# EAGLE design EduBasicaV2 (EAGLE 6.5.0)
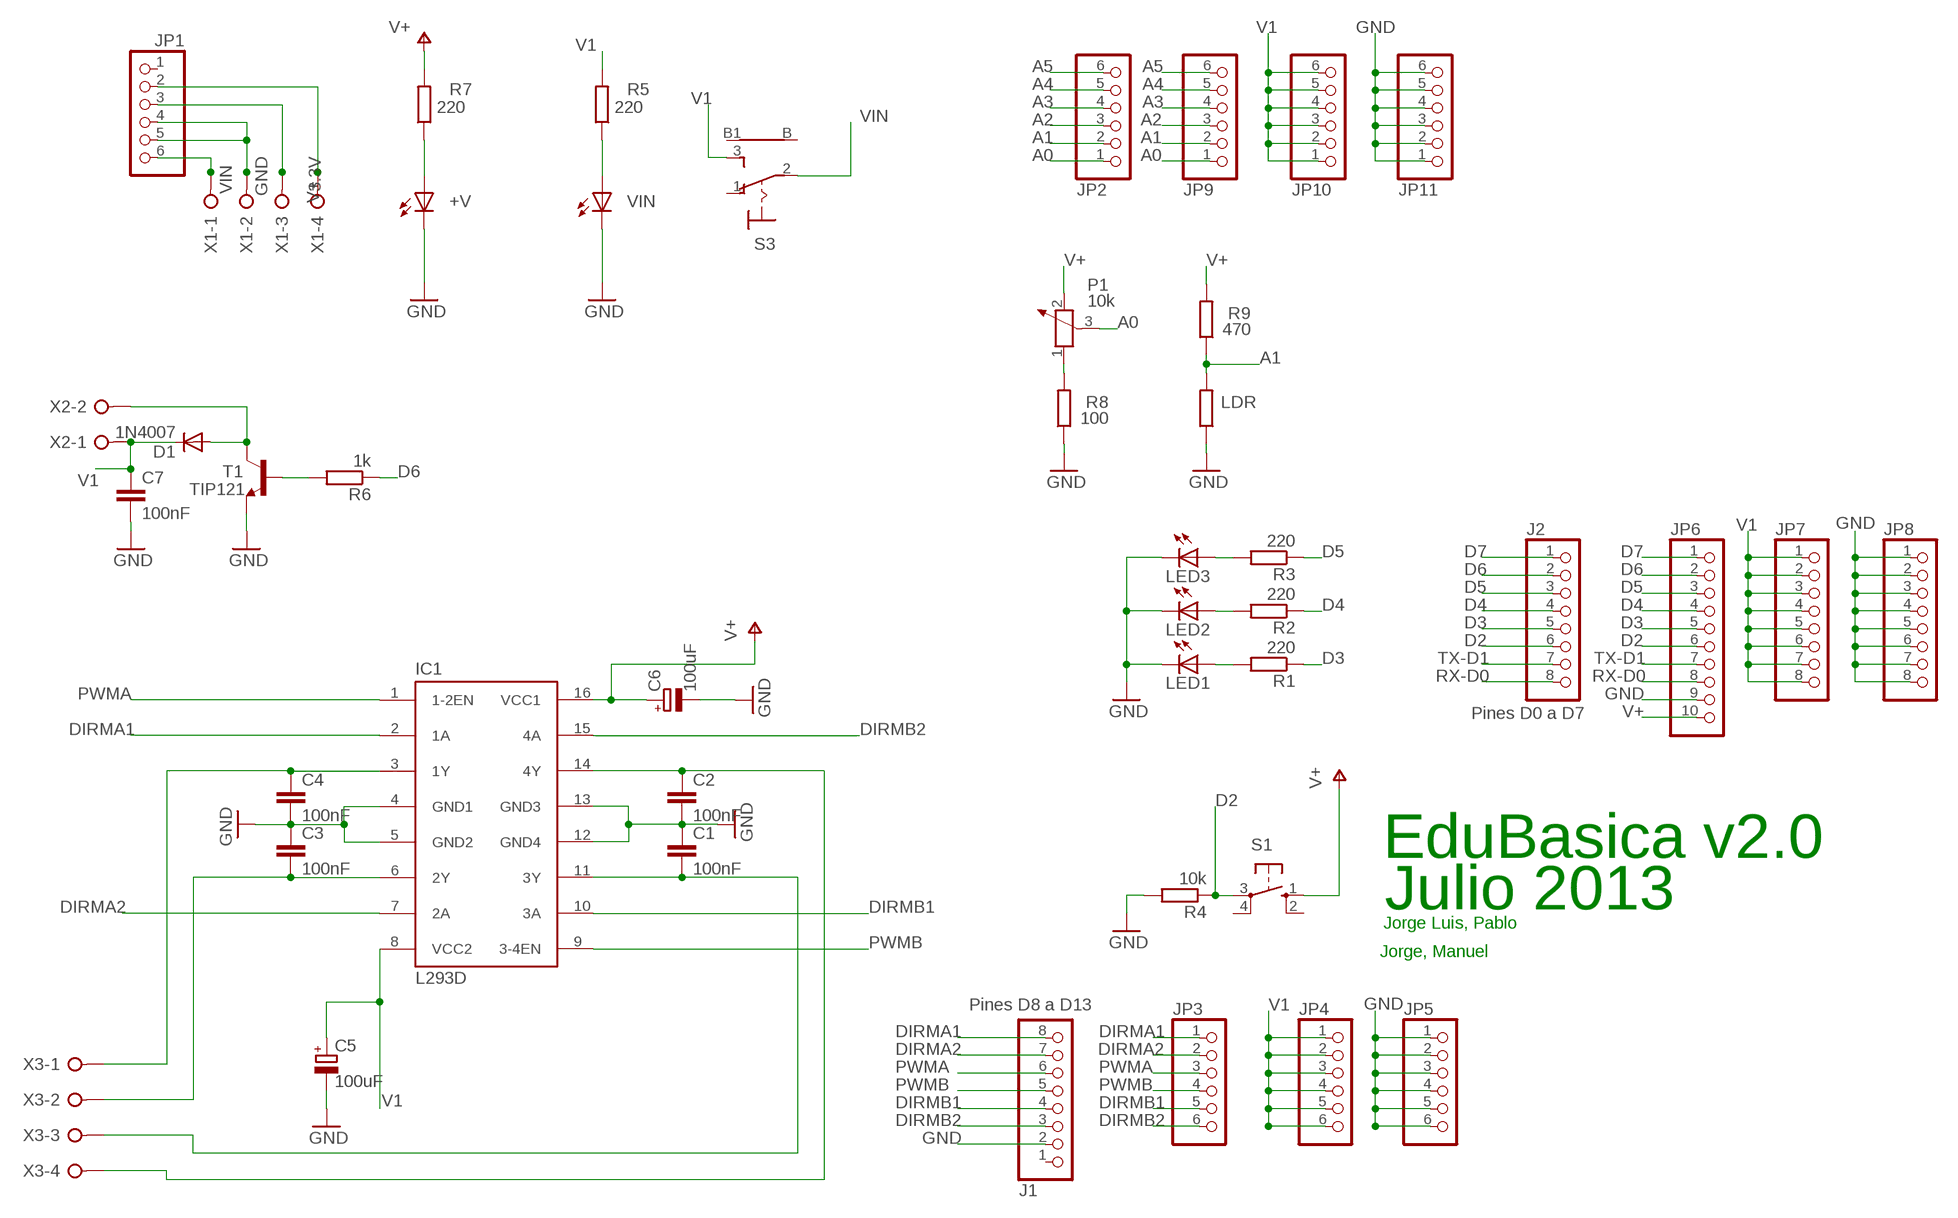
[diagram p0: schematic, sheet 1]

## Parts
+V  LED3MM  [LED3MM]
C1  100nF  C5/5.5  [C5B5.5]
C2  100nF  C5/5.5  [C5B5.5]
C3  100nF  C5/5.5  [C5B5.5]
C4  100nF  C5/5.5  [C5B5.5]
C5  100uF  CPOL-EUE2.5-5  [E2,5-5]
C6  100uF  CPOL-EUE2.5-5  [E2,5-5]
C7  100nF  C5/5.5  [C5B5.5]
D1  1N4007  DIODE-D-7.5  [D-7.5]
IC1  L293D  L293E  [DIL16]
J1  Pines D8 a D13  PINHD-1X8  [1X08]
J2  Pines D0 a D7  PINHD-1X8  [1X08]
JP1  PINHD-1X6  [1X06]
JP2  PINHD-1X6  [1X06]
JP3  PINHD-1X6  [1X06]
JP4  PINHD-1X6  [1X06]
JP5  PINHD-1X6  [1X06]
JP6  PINHD-1X10  [1X10]
JP7  PINHD-1X8  [1X08]
JP8  PINHD-1X8  [1X08]
JP9  PINHD-1X6  [1X06]
JP10  PINHD-1X6  [1X06]
JP11  PINHD-1X6  [1X06]
LDR  R-EU_0204/2V  [0204V]
LED1  LED5MM  [LED5MM]
LED2  LED5MM  [LED5MM]
LED3  LED5MM  [LED5MM]
P1  10k  POTENTIOMETER_PT-10  [PT-10]
R1  220  R-EU_0204/7  [0204/7]
R2  220  R-EU_0204/7  [0204/7]
R3  220  R-EU_0204/7  [0204/7]
R4  10k  R-EU_0204/7  [0204/7]
R5  220  R-EU_0204/7  [0204/7]
R6  1k  R-EU_0204/7  [0204/7]
R7  220  R-EU_0204/7  [0204/7]
R8  100  R-EU_0204/7  [0204/7]
R9  470  R-EU_0204/7  [0204/7]
S1  10-XX  [B3F-10XX]
S3  9070-1W  [9070-1W]
T1  TIP121  -NPN-TO220V  [TO220V]
VIN  LED3MM  [LED3MM]
X1  W237-04P  [W237-4P]
X2  W237-02P  [W237-132]
X3  W237-04P  [W237-4P]

## Nets
3.3V: JP1.2 X1.4
A0: JP2.1 JP9.1 P1.3
A1: JP2.2 JP9.2 LDR.2 R9.1
A2: JP2.3 JP9.3
A3: JP2.4 JP9.4
A4: JP2.5 JP9.5
A5: JP2.6 JP9.6
D2: J2.6 JP6.6 R4.1 S1.3(P)
D3: J2.5 JP6.5 R1.1
D4: J2.4 JP6.4 R2.1
D5: J2.3 JP6.3 R3.1
D6: J2.2 JP6.2 R6.1
D7: J2.1 JP6.1
DIRMA1: IC1.2(1A) J1.8 JP3.1
DIRMA2: IC1.7(2A) J1.7 JP3.2
DIRMB1: IC1.10(3A) J1.4 JP3.5
DIRMB2: IC1.15(4A) J1.3 JP3.6
GND: +V.K(C) C1.1 C2.2 C3.1 C4.2 C5.- C6.- C7.2 IC1.4(GND1) IC1.5(GND2) IC1.12(GND4) IC1.13(GND3) J1.2 JP1.4 JP1.5 JP5.1 JP5.2 JP5.3 JP5.4 JP5.5 JP5.6 JP6.9 JP8.1 JP8.2 JP8.3 JP8.4 JP8.5 JP8.6 JP8.7 JP8.8 JP11.1 JP11.2 JP11.3 JP11.4 JP11.5 JP11.6 LDR.1 LED1.K(C) LED2.K(C) LED3.K(C) R4.2 R8.1 T1.3(E) VIN.K(C) X1.2
N$2: R6.2 T1.1(B)
N$3: D1.A T1.2(C) X2.2
N$4: P1.1 R8.2
N$6: R5.1 VIN.A
N$8: LED3.A R3.2
N$9: LED2.A R2.2
N$10: LED1.A R1.2
N$16: JP7.7
N$30: C4.1 IC1.3(1Y) X3.1
N$31: C3.2 IC1.6(2Y) X3.2
N$32: C1.2 IC1.11(3Y) X3.3
N$33: C2.1 IC1.14(4Y) X3.4
N$35: +V.A R7.1
PWMA: IC1.1(1-2EN) J1.6 JP3.3
PWMB: IC1.9(3-4EN) J1.5 JP3.4
RX-D0: J2.8 JP6.8
TX-D1: J2.7 JP6.7
V1: C5.+ C7.1 D1.C IC1.8(VCC2) JP4.1 JP4.2 JP4.3 JP4.4 JP4.5 JP4.6 JP7.1 JP7.2 JP7.3 JP7.4 JP7.5 JP7.6 JP7.8 JP10.1 JP10.2 JP10.3 JP10.4 JP10.5 JP10.6 R5.2 S3.3(S) X2.1
V+: C6.+ IC1.16(VCC1) JP1.3 JP6.10 P1.2 R7.2 R9.2 S1.1(S) X1.3
VIN [power]: JP1.6 S3.2(P) X1.1
Unconnected: J1.1 JP1.1 S1.2(S1) S1.4(P1) S3.1(O) S3.B S3.B1

## Notes on the sheet
- EduBasica v2.0
- Julio 2013
- Jorge Luis, Pablo
- Jorge, Manuel

## Library data of the parts
+V LED1-LED3 VIN = led:LED: LED OSRAM: - CHIPLED LG R971, LG N971, LY N971, LG Q971, LY Q971, LO R971, LY R971 LH N974, LH R974 LS Q976, LO Q976, LY Q976 LO Q996 - Hyper CHIPLED LW Q18S LB Q993, LB Q99A, LB R99A - SideLED LS A670, LO A670, LY A670, LG A670, LP A670 LB A673, LV A673, LT A673, LW A673 LH A674 LY A675 LS A676, LA A676, LO A676, LY A676, LW A676 LS A679, LY A679, LG A679 - Hyper Micro SIDELED® LS Y876, LA Y876, LO Y876, LY Y876 LT Y87S - SmartLED LW L88C, LW L88S LB L89C, LB L89S, LG L890 LS L89K, LO L89K, LY L89K LS L896, LA L896, LO L896, LY L896 - TOPLED LS T670, LO T670, LY T670, LG T670, LP T670 LSG T670, LSP T670, LSY T670, LOP T670, LYG T670 LG T671, LOG T671, LSG T671 LB T673, LV T673, LT T673, LW T673 LH T674 LS T676, LA T676, LO T676, LY T676, LB T676, LH T676, LSB T676, LW T676 LB T67C, LV T67C, LT T67C, LS T67K, LO T67K, LY T67K, LW E67C LS E67B, LA E67B, LO E67B, LY E67B, LB E67C, LV E67C, LT E67C LW T67C LS T679, LY T679, LG T679 LS T770, LO T770, LY T770, LG T770, LP T770 LB T773, LV T773, LT T773, LW T773 LH T774 LS E675, LA E675, LY E675, LS T675 LS T776, LA T776, LO T776, LY T776, LB T776 LHGB T686 LT T68C, LB T68C - Hyper Mini TOPLED® LB M676 - Mini TOPLED Santana® LG M470 LS M47K, LO M47K, LY M47K Source: http://www.osram.convergy.de LUXEON: - LUMILED® LXK2-PW12-R00, LXK2-PW12-S00, LXK2-PW14-U00, LXK2-PW14-V00 LXK2-PM12-R00, LXK2-PM12-S00, LXK2-PM14-U00 LXK2-PE12-Q00, LXK2-PE12-R00, LXK2-PE12-S00, LXK2-PE14-T00, LXK2-PE14-U00 LXK2-PB12-K00, LXK2-PB12-L00, LXK2-PB12-M00, LXK2-PB14-N00, LXK2-PB14-P00, LXK2-PB14-Q00 LXK2-PR12-L00, LXK2-PR12-M00, LXK2-PR14-Q00, LXK2-PR14-R00 LXK2-PD12-Q00, LXK2-PD12-R00, LXK2-PD12-S00 LXK2-PH12-R00, LXK2-PH12-S00 LXK2-PL12-P00, LXK2-PL12-Q00, LXK2-PL12-R00 Source: www.luxeon.com KINGBRIGHT: KA-3528ASYC Source: www.kingbright.com
C1-C4 C7 = capacitor-wima:C: CAPACITOR naming: grid - package width
C5 C6 = rcl:CPOL-EU: POLARIZED CAPACITOR, European symbol
D1 = diode:DIODE-: DIODE
IC1 = texas:L293E: TI DEVICE
J1 J2 JP7 JP8 = pinhead:PINHD-1X8: PIN HEADER
JP1-JP5 JP9-JP11 = pinhead:PINHD-1X6: PIN HEADER
JP6 = pinhead:PINHD-1X10: PIN HEADER
LDR R1-R9 = rcl:R-EU_: RESISTOR, European symbol
P1 = rcl:POTENTIOMETER_: Potentiometer
S1 = switch-omron:10-XX: OMRON SWITCH; MPN: B3F-1000; OC_FARNELL: 176432; OC_NEWARK: 36M3542
S3 = switch:9070-1W: TOGGLE SWITCH Marquardt
T1 = transistor:*-NPN-: NPN Transistror BF959 corrected 2008.03.06
X1 X3 = con-wago-508:W237-04P: WAGO SREW CLAMP; OC_FARNELL: unknown; OC_NEWARK: unknown
X2 = con-wago-508:W237-02P: WAGO SREW CLAMP; OC_FARNELL: unknown; OC_NEWARK: unknown

## Net classes
1 power: width 0.61 mm

## Board
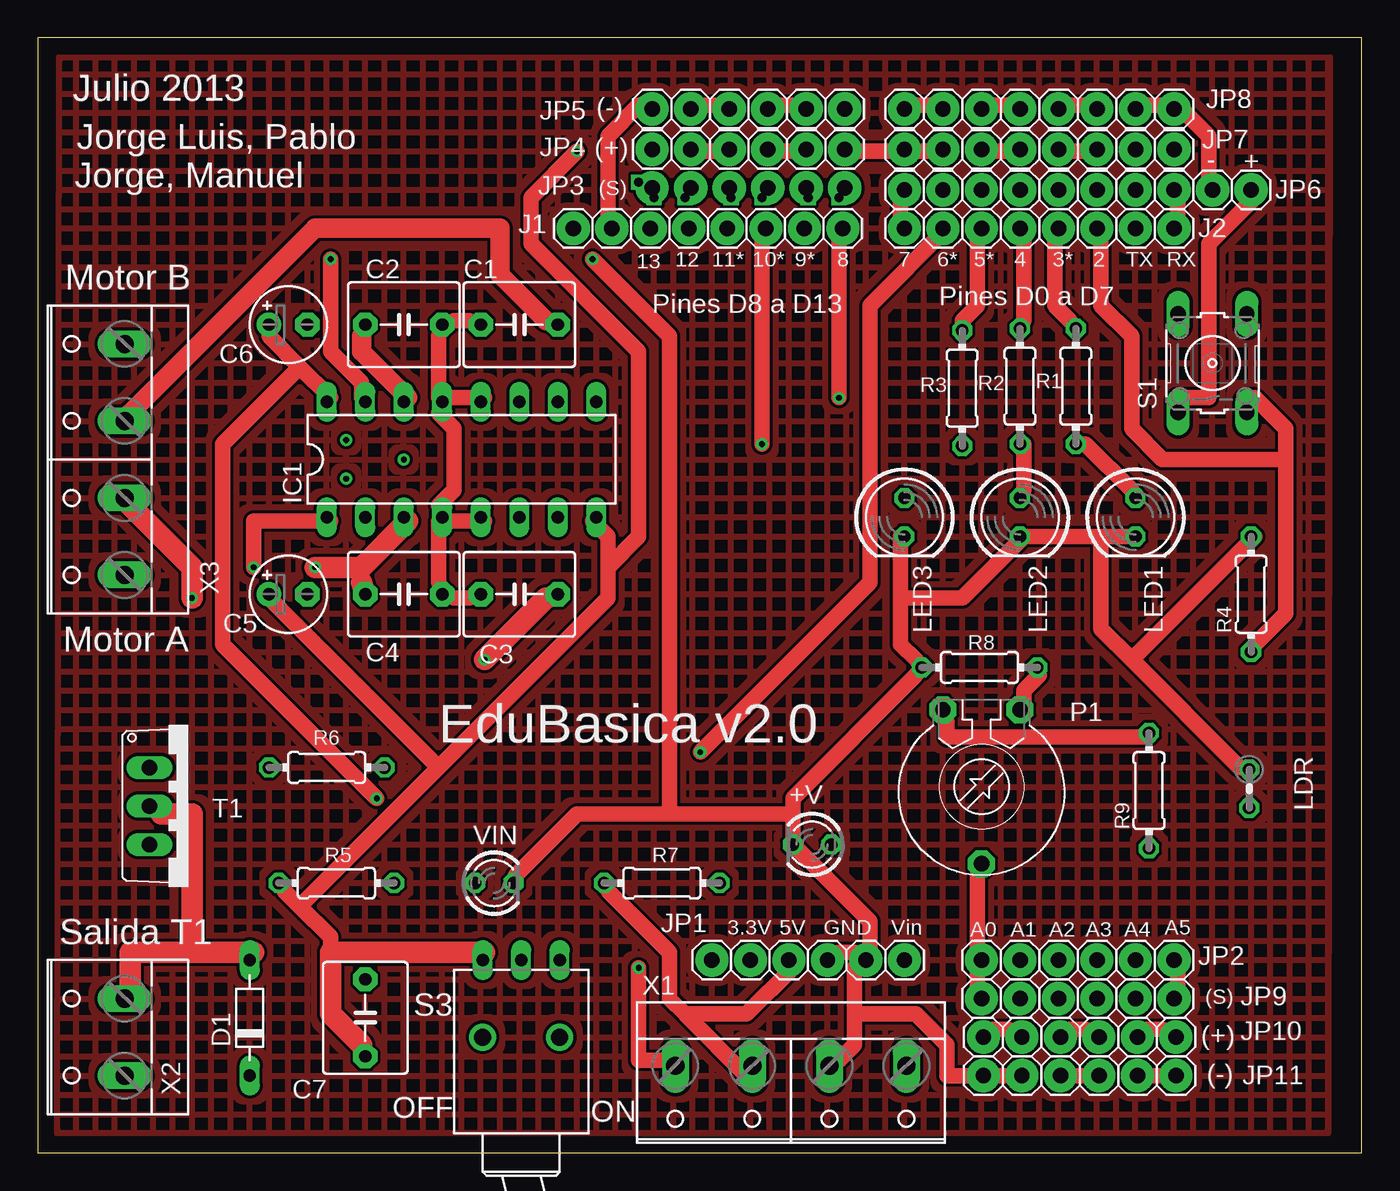
[diagram p1: board, top side]
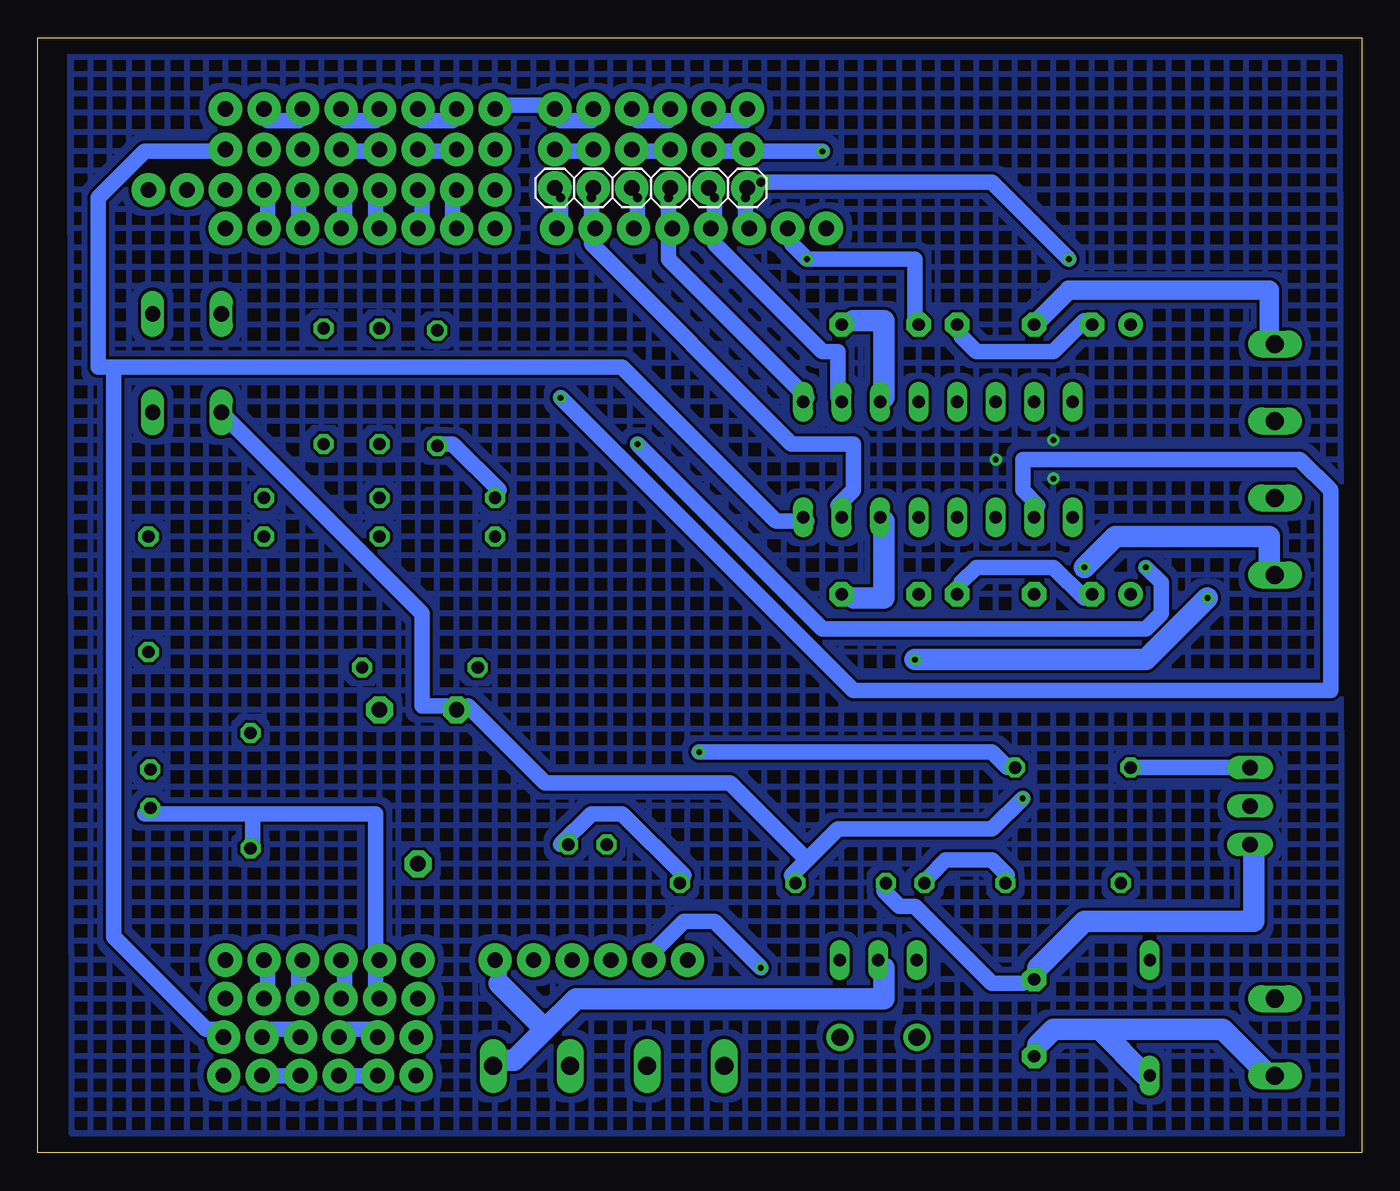
[diagram p2: board, bottom side, seen from below]

Size 87.3 x 73.52 mm. Coordinates in mm from the lower left corner, seen from the top.
Outline: 0,0 87.3,0 87.3,73.52 0,73.52 0,0
Copper layers (1*16): Top 0.035mm / dielectric 1.5mm / Bottom 0.035mm
Design rules "default *": minimum track width 40mil, minimum drill 15mil, track to track 8mil, track to pad 8mil, pad to pad 8mil, via to via 8mil, smd to smd 8mil, copper to edge 40mil, drill to drill 8mil, minimum pad ring 10mil, minimum via ring 8mil, stop-mask expansion 4mil, vias tented up to drill 0mil, thermal gap 10mil

### Footprints (pad centres in the part's own frame; a part is rotated, then mirrored left to right if it is on the bottom)
LED3MM = drill 0.813 octagon: A -1.27,0; K 1.27,0
C5B5.5 = drill 0.813 pad 1.6 octagon: 1 -2.54,0; 2 2.54,0
E2,5-5 = drill 0.813 pad 1.6: + -1.27,0 | drill 0.813 pad 1.6 octagon: - 1.27,0
D-7.5 = drill 0.813 long: A 3.81,0; C -3.81,0
DIL16 = drill 0.813 long: 1 -8.89,-3.81; 2 -6.35,-3.81; 3 -3.81,-3.81; 4 -1.27,-3.81; 5 1.27,-3.81; 6 3.81,-3.81; 7 6.35,-3.81; 8 8.89,-3.81; 9 8.89,3.81; 10 6.35,3.81; 11 3.81,3.81; 12 1.27,3.81; 13 -1.27,3.81; 14 -3.81,3.81; 15 -6.35,3.81; 16 -8.89,3.81
1X08 = drill 1.016 pad 2.184: 1 -8.89,0; 2 -6.35,0; 3 -3.81,0; 4 -1.27,0; 5 1.27,0; 6 3.81,0; 7 6.35,0; 8 8.89,0
1X06 = drill 1.016 pad 2.184: 1 -6.35,0; 2 -3.81,0; 3 -1.27,0; 4 1.27,0; 5 3.81,0; 6 6.35,0
1X10 = drill 1.016 pad 2.184: 1 -11.43,0; 2 -8.89,0; 3 -6.35,0; 4 -3.81,0; 5 -1.27,0; 6 1.27,0; 7 3.81,0; 8 6.35,0; 9 8.89,0; 10 11.43,0
0204V = drill 0.813 octagon: 1 -1.27,0; 2 1.27,0
LED5MM = drill 0.813 octagon: A -1.27,0; K 1.27,0
PT-10 = drill 1.016 pad 1.778 octagon: 1 -2.54,-5.08; 2 2.54,-5.08; 3 0,5.08
0204/7 = drill 0.813 octagon: 1 -3.81,0; 2 3.81,0
B3F-10XX = drill 1.016 long: 1 -3.251,2.261; 2 3.251,2.261; 3 -3.251,-2.261; 4 3.251,-2.261
9070-1W = drill 0.813 long: 1 5.08,-2.54; 2 5.08,0; 3 5.08,2.54 | drill 1.118 pad 1.778: B 0,-2.54; B1 0,2.54
TO220V = drill 1.016 long: 1 -2.54,-2.54; 2 0,-2.54; 3 2.54,-2.54
W237-4P = drill 1.194 long: 1 -7.62,-0.635; 2 -2.54,-0.635; 3 2.54,-0.635; 4 7.62,-0.635
W237-132 = drill 1.194 long: 1 -2.54,-0.635; 2 2.54,-0.635

### Placement (x,y rotation side)
+V  51.05,20.32 180 top
C1  31.75,54.61 0 top
C2  24.13,54.61 0 top
C3  31.75,36.83 0 top
C4  24.13,36.83 0 top
C5  16.51,36.83 0 top
C6  16.51,54.61 0 top
C7  21.59,8.89 90 top
D1  13.97,8.89 90 top
IC1  27.94,45.72 0 top
J1  44.2,60.96 0 top
J2  66.04,60.96 0 top
JP1  50.8,12.7 0 top
JP2  68.58,12.7 0 top
JP3  46.86,63.63 0 bottom
JP4  46.86,66.17 0 top
JP5  46.86,68.83 0 top
JP6  68.58,63.5 0 top
JP7  66.04,66.17 0 top
JP8  66.04,68.83 0 top
JP9  68.58,10.16 0 top
JP10  68.71,7.62 0 top
JP11  68.71,5.08 0 top
LDR  79.88,24 270 top
LED1  72.39,41.91 270 top
LED2  64.77,41.91 270 top
LED3  57.15,41.91 270 top
P1  62.23,24.13 180 top
R1  68.45,50.55 270 top
R2  64.77,50.55 270 top
R3  60.96,50.42 270 top
R4  80.01,36.83 90 top
R5  19.68,17.78 180 top
R6  19.05,25.4 180 top
R7  41.15,17.78 180 top
R8  62.1,32 0 top
R9  73.28,23.88 90 top
S1  77.47,52.07 90 top
S3  31.88,7.62 90 top
T1  9.91,22.86 270 top
VIN  30.1,17.78 0 top
X1  49.66,5.08 180 top
X2  5.08,7.62 90 top
X3  5.08,45.72 90 top

### Tracks (layer width: path | path; a pad name or v marks a point on that pad's centre or on a via)
3.3V  (via drill 0.38)
  Top 1.016: v39.62,12.19 39.62,6.1 41.66,6.1 X1.4
  Bottom 1.016: v39.62,12.19 42.67,15.24 44.7,15.24 46.74,13.21 JP1.2
A0
  Top 1.016: P1.3 61.98,18.29 61.98,13.21 JP2.1 61.98,12.19 61.98,10.16 JP9.1
A1
  Bottom 1.016: JP9.2 65.02,10.16 65.02,12.19 JP2.2 65.02,13.21 65.02,22.35 73.15,22.35 | 73.15,22.35 73.15,20.32 R9.1 | 73.15,22.35 80.26,22.35 LDR.2
A2
  Bottom 1.016: JP9.3 67.06,10.16 67.06,12.19 JP2.3
A3
  Bottom 1.016: JP9.4 70.1,10.16 70.1,12.19 JP2.4
A4
  Bottom 1.016: JP9.5 72.14,10.16 72.14,12.19 JP2.5
A5
  Top 1.016: JP9.6 75.18,10.16 75.18,12.19 JP2.6
D2
  Top 1.016: 82.3,45.72 82.3,47.75 80.26,49.78 S1.3 | 82.3,45.72 82.3,35.56 80.26,33.53 R4.1 | 82.3,45.72 74.17,45.72 72.14,47.75 72.14,53.85 70.1,55.88 70.1,60.96 J2.6
  Bottom 1.016: J2.6 70.1,60.96 70.1,62.99 JP6.6
D3
  Top 1.016: R1.1 68.07,54.86 67.06,55.88 67.06,60.96 J2.5
  Bottom 1.016: JP6.5 67.06,62.99 67.06,60.96 J2.5
D4
  Top 1.016: R2.1 65.02,54.86 65.02,60.96 J2.4
  Bottom 1.016: JP6.4 65.02,62.99 65.02,60.96 J2.4
D5
  Top 1.016: R3.1 60.96,54.86 61.98,55.88 61.98,60.96 J2.3
  Bottom 1.016: JP6.3 61.98,62.99 61.98,60.96 J2.3
D6  (via drill 0.38)
  Top 1.016: v43.69,26.42 54.86,37.59 54.86,55.88 59.94,60.96 J2.2
  Bottom 1.016: v43.69,26.42 24.38,26.42 23.37,25.4 R6.1 | JP6.2 59.94,62.99 59.94,60.96 J2.2
D7
  Top 1.016: J2.1 56.9,60.96 56.9,62.99 JP6.1
DIRMA1  (via drill 0.38, 0.6)
  Top 1.016: v52.83,49.78 52.83,60.96 J1.8
  Bottom 1.016: v52.83,49.78 33.53,30.48 2.03,30.48 2.03,43.69 4.06,45.72 22.35,45.72 22.35,43.69 21.34,42.67 IC1.2 | JP3.1 v52.83,62.99 52.83,60.96 J1.8
DIRMA2  (via drill 0.6)
  Bottom 1.016: 50.8,60.96 50.8,59.94 37.59,46.74 33.53,46.74 33.53,43.69 34.54,42.67 IC1.7 | 50.8,60.96 v50.8,62.99 JP3.2 | 50.8,60.96 J1.7
DIRMB1  (via drill 0.6)
  Bottom 1.016: 42.67,60.96 42.67,59.94 35.56,52.83 34.54,52.83 34.54,49.78 IC1.10 | 42.67,60.96 v42.67,62.99 JP3.5 | 42.67,60.96 J1.4
DIRMB2  (via drill 0.38, 0.6)
  Top 1.016: v19.3,58.93 19.3,52.83 21.34,50.8 21.34,49.78 IC1.15
  Bottom 1.016: v19.3,58.93 24.38,64.01 v39.62,64.01 JP3.6 v40.64,62.99 40.64,60.96 J1.3
GND  (via drill 0.38)
  Top 1.016: 26.42,41.66 29.46,41.66 IC1.5 | C3.1 28.45,36.58 27.43,36.58 C4.2 26.42,37.59 26.42,41.66 | 26.42,41.66 IC1.4 26.42,42.67 27.43,43.69 27.43,47.75 26.42,48.77 IC1.13 26.42,49.78 | 26.42,49.78 29.46,49.78 IC1.12 | C1.1 28.45,54.86 27.43,54.86 C2.2 26.42,53.85 26.42,49.78 | JP5.4 48.77,69.09 49.78,69.09 JP5.5 | JP5.2 43.69,69.09 44.7,69.09 JP5.3 | J1.2 37.59,60.96 37.59,67.06 39.62,69.09 JP5.1 | JP8.7 73.15,69.09 74.17,69.09 JP8.8 75.18,69.09 77.22,67.06 77.22,64.01 JP6.9 | JP8.5 68.07,69.09 69.09,69.09 JP8.6 | JP8.1 57.91,69.09 58.93,69.09 JP8.2 | JP8.3 62.99,69.09 64.01,69.09 JP8.4 | 56.9,36.58 56.9,33.53 57.91,32.51 R8.1 57.91,31.5 49.78,23.37 49.78,22.35 | 56.9,36.58 56.9,40.64 LED3.K | 65.02,40.64 60.96,36.58 56.9,36.58 | 65.02,40.64 70.1,40.64 | 70.1,40.64 LED1.K | 65.02,40.64 LED2.K | 72.14,32.51 70.1,34.54 70.1,40.64 | 72.14,32.51 79.25,25.4 LDR.1 | 72.14,32.51 80.26,40.64 R4.2 | JP11.5 JP11.6 | JP11.2 JP11.1 59.94,5.08 59.94,7.11 57.91,9.14 53.85,9.14 | JP11.3 JP11.4 | JP1.5 54.86,13.21 54.86,15.24 +V.K 49.78,22.35 | 53.85,9.14 53.85,12.19 JP1.5 | 53.85,9.14 53.85,7.11 52.83,6.1 X1.2 | JP1.4 52.83,13.21 53.85,13.21 JP1.5 | 41.66,22.35 49.78,22.35 | 41.66,22.35 35.56,22.35 31.5,18.29 VIN.K | v36.58,58.93 41.66,53.85 41.66,22.35
  Bottom 1.016: C5.- 18.29,36.58 20.32,38.61 25.4,38.61 26.42,37.59 C4.2 | C6.- 18.29,54.86 20.32,52.83 25.4,52.83 26.42,53.85 C2.2 | JP5.5 50.8,68.07 52.83,68.07 JP5.6 53.85,69.09 56.9,69.09 JP8.1 | JP5.2 42.67,68.07 40.64,68.07 JP5.1 | JP5.4 47.75,68.07 45.72,68.07 JP5.3 | JP8.2 59.94,68.07 61.98,68.07 JP8.3 | JP8.5 67.06,68.07 65.02,68.07 JP8.4 | JP8.7 72.14,68.07 70.1,68.07 JP8.6 | C1.1 29.46,54.86 29.46,58.93 v36.58,58.93 37.59,59.94 37.59,60.96 J1.2 | VIN.K 31.5,17.27 30.48,16.26 29.46,16.26 24.38,11.18 22.35,11.18 C7.2 21.34,12.19 | 7.11,20.32 T1.3 | JP11.2 JP11.3 | JP11.4 JP11.5
  Bottom 1.422: 7.11,20.32 7.11,15.24 18.29,15.24 21.34,12.19
N$1  (via drill 0.38)
  other vias: 20.32,46.99 20.32,44.45 24.13,45.72
  pour Bottom (hatched): 1.27,1.27 1.4,72.26 85.22,72.39 85.09,1.27
N$2
  Bottom 1.016: T1.1 R6.2
N$3
  Top 1.016: 14.22,13.21 D1.A | X2.2 6.1,10.16 | 8.13,22.35 T1.2
  Top 1.422: 10.16,13.21 6.1,13.21 6.1,10.16 | 10.16,13.21 14.22,13.21 | 8.13,22.35 10.16,22.35 10.16,13.21
N$4
  Top 1.016: R8.2 66.04,31.5 65.02,30.48 65.02,29.46 P1.1
N$5
  pour Top (hatched): 1.27,1.27 1.4,72.26 85.22,72.26 85.09,1.27
N$6
  Bottom 1.016: R5.1 23.37,18.29 24.38,19.3 27.43,19.3 28.45,18.29 VIN.A
N$8
  Bottom 1.016: LED3.A 56.9,43.69 59.94,46.74 60.96,46.74 R3.2
N$9
  Top 1.016: LED2.A 65.02,43.69 65.02,46.74 R2.2
N$10
  Top 1.016: R1.2 69.09,46.74 72.14,43.69 LED1.A
N$30  (via drill 0.38)
  Top 1.016: 21.34,38.61 21.34,37.59 | 24.38,41.66 IC1.3
  Top 1.422: 24.38,41.66 21.34,38.61 v18.29,38.61 | 21.34,37.59 C4.1
  Bottom 1.016: X3.1 6.1,38.61
  Bottom 1.422: 6.1,38.61 6.1,40.64 16.26,40.64 v18.29,38.61
N$31  (via drill 0.38)
  Top 1.016: 6.1,42.67 X3.2 | 33.53,36.58 C3.2
  Top 1.422: 6.1,42.67 10.16,38.61 v10.16,36.58 | v29.46,32.51 33.53,36.58
  Bottom 1.016: 31.5,41.66 IC1.6 | C3.2 33.53,36.58
  Bottom 1.422: 31.5,41.66 31.5,36.58 33.53,36.58 | v10.16,36.58 14.22,32.51 v29.46,32.51
N$32
  Top 1.016: X3.3 6.1,48.77 | 33.53,54.86 C1.2
  Top 1.27: 6.1,48.77 18.29,60.96 30.48,60.96 30.48,57.91 33.53,54.86
  Bottom 1.016: 31.5,49.78 IC1.11 | C1.2 33.53,54.86
  Bottom 1.422: 31.5,49.78 31.5,54.86 33.53,54.86
N$33
  Top 1.016: 24.38,49.78 IC1.14 | C2.1 21.34,53.85
  Top 1.27: 24.38,49.78 21.34,52.83 21.34,53.85
  Bottom 1.016: X3.4 6.1,53.85
  Bottom 1.27: 6.1,53.85 6.1,56.9 19.3,56.9 C2.1
N$35
  Bottom 1.016: R7.1 44.7,18.29 48.77,22.35 50.8,22.35 52.83,20.32 +V.A
PWMA  (via drill 0.38, 0.6)
  Top 1.016: v14.22,38.61 14.22,41.66 19.3,41.66 IC1.1 | v47.75,46.74 47.75,60.96 J1.6
  Bottom 1.016: v14.22,38.61 13.21,37.59 13.21,35.56 14.22,34.54 35.56,34.54 v47.75,46.74 | JP3.3 v47.75,62.99 47.75,60.96 J1.6
PWMB  (via drill 0.6)
  Bottom 1.016: 45.72,60.96 45.72,58.93 36.58,49.78 IC1.9 | 45.72,60.96 v45.72,62.99 JP3.4 | 45.72,60.96 J1.5
RX-D0
  Top 1.016: J2.8 75.18,60.96 75.18,62.99 JP6.8
TX-D1
  Bottom 1.016: J2.7 72.14,60.96 72.14,62.99 JP6.7
V1  (via drill 0.38)
  Top 1.016: JP4.3 44.7,66.04 43.69,66.04 JP4.2 | JP4.4 48.77,66.04 49.78,66.04 JP4.5 | JP7.5 68.07,66.04 69.09,66.04 JP7.6 | JP7.2 58.93,66.04 57.91,66.04 JP7.1 56.9,66.04 53.85,66.04 JP4.6 | JP7.3 62.99,66.04 64.01,66.04 JP7.4 | JP10.5 73.15,8.13 74.17,8.13 JP10.6 | JP10.1 62.99,8.13 64.01,8.13 JP10.2 | JP10.3 68.07,8.13 69.09,8.13 JP10.4 | 17.27,16.26 19.3,14.22 19.3,13.21 | 17.27,16.26 16.26,17.27 R5.2 | C7.1 21.34,7.11 | 29.46,13.21 S3.3 | 37.59,38.61 37.59,36.58 26.42,25.4 | 37.59,38.61 37.59,40.64 36.58,41.66 IC1.8 | 17.27,16.26 26.42,25.4 | 26.42,25.4 15.24,36.58 C5.+ | v35.56,66.04 32.51,62.99 32.51,59.94 39.62,52.83 39.62,40.64 37.59,38.61
  Top 1.422: 21.34,7.11 19.3,9.14 19.3,13.21 29.46,13.21
  Bottom 1.016: JP4.2 42.67,66.04 40.64,66.04 JP4.1 39.62,66.04 v35.56,66.04 | JP4.6 52.83,66.04 50.8,66.04 JP4.5 | JP4.3 45.72,66.04 47.75,66.04 JP4.4 | JP7.2 59.94,66.04 61.98,66.04 JP7.3 | JP7.5 67.06,66.04 65.02,66.04 JP7.4 | JP10.2 65.02,8.13 67.06,8.13 JP10.3 | JP10.5 72.14,8.13 70.1,8.13 JP10.4 | 14.22,5.08 D1.C | 21.34,7.11 C7.1 | X2.1 6.1,5.08 | 82.3,51.82 48.77,51.82 38.61,41.66 36.58,41.66 IC1.8 | 82.3,51.82 83.31,51.82 83.31,62.99 80.26,66.04 75.18,66.04 JP7.8 | 82.3,51.82 82.3,14.22 76.2,8.13 75.18,8.13 JP10.6
  Bottom 1.422: 17.27,8.13 14.22,5.08 | 17.27,8.13 20.32,8.13 21.34,7.11 | 6.1,5.08 9.14,8.13 17.27,8.13
V+  (via drill 0.38)
  Top 1.016: S1.1 75.18,49.78 77.22,49.78 77.22,59.94 80.26,62.99 JP6.10 | R9.2 73.15,27.43 59.94,27.43 59.94,28.45 P1.2 | 17.27,51.82 15.24,53.85 C6.+ | 17.27,51.82 19.3,49.78 IC1.16 | 42.67,9.14 46.74,5.08 X1.3 | 42.67,9.14 41.66,10.16 41.66,13.21 37.59,17.27 R7.2 | 42.67,9.14 46.74,9.14 49.78,12.19 JP1.3 | 17.27,51.82 12.19,46.74 12.19,33.53 v22.35,23.37
  Bottom 1.016: v22.35,23.37 24.38,21.34 34.54,21.34 36.58,19.3 | 36.58,19.3 37.59,18.29 R7.2 | 36.58,19.3 41.66,24.38 53.85,24.38 58.93,29.46 P1.2 59.94,29.46 61.98,29.46 61.98,35.56 75.18,48.77 S1.1
VIN
  Bottom 1.016: 31.5,12.19 S3.2 | 56.9,6.1 X1.1 | 56.9,11.18 56.9,12.19 JP1.6
  Bottom 1.422: 31.5,12.19 31.5,10.16 51.82,10.16 53.85,8.13 | 53.85,8.13 55.88,6.1 56.9,6.1 | 53.85,8.13 56.9,11.18

### Text on the board
tPlace: Julio 2013 | (-) | Jorge Luis, Pablo | (+) | - | + | Jorge, Manuel | (S) | 13 | 12 | 11* | 10* | 9* | 8 | 7 | 6* | 5* | 4 | 3* | 2 | TX | RX | Motor B | Motor A | EduBasica v2.0 | Salida T1 | 3.3V | 5V | GND | Vin | A0 | A1 | A2 | A3 | A4 | A5 | (S) | (+) | (-) | OFF | ON